# EAGLE design capsense-board (EAGLE 7.4.0)
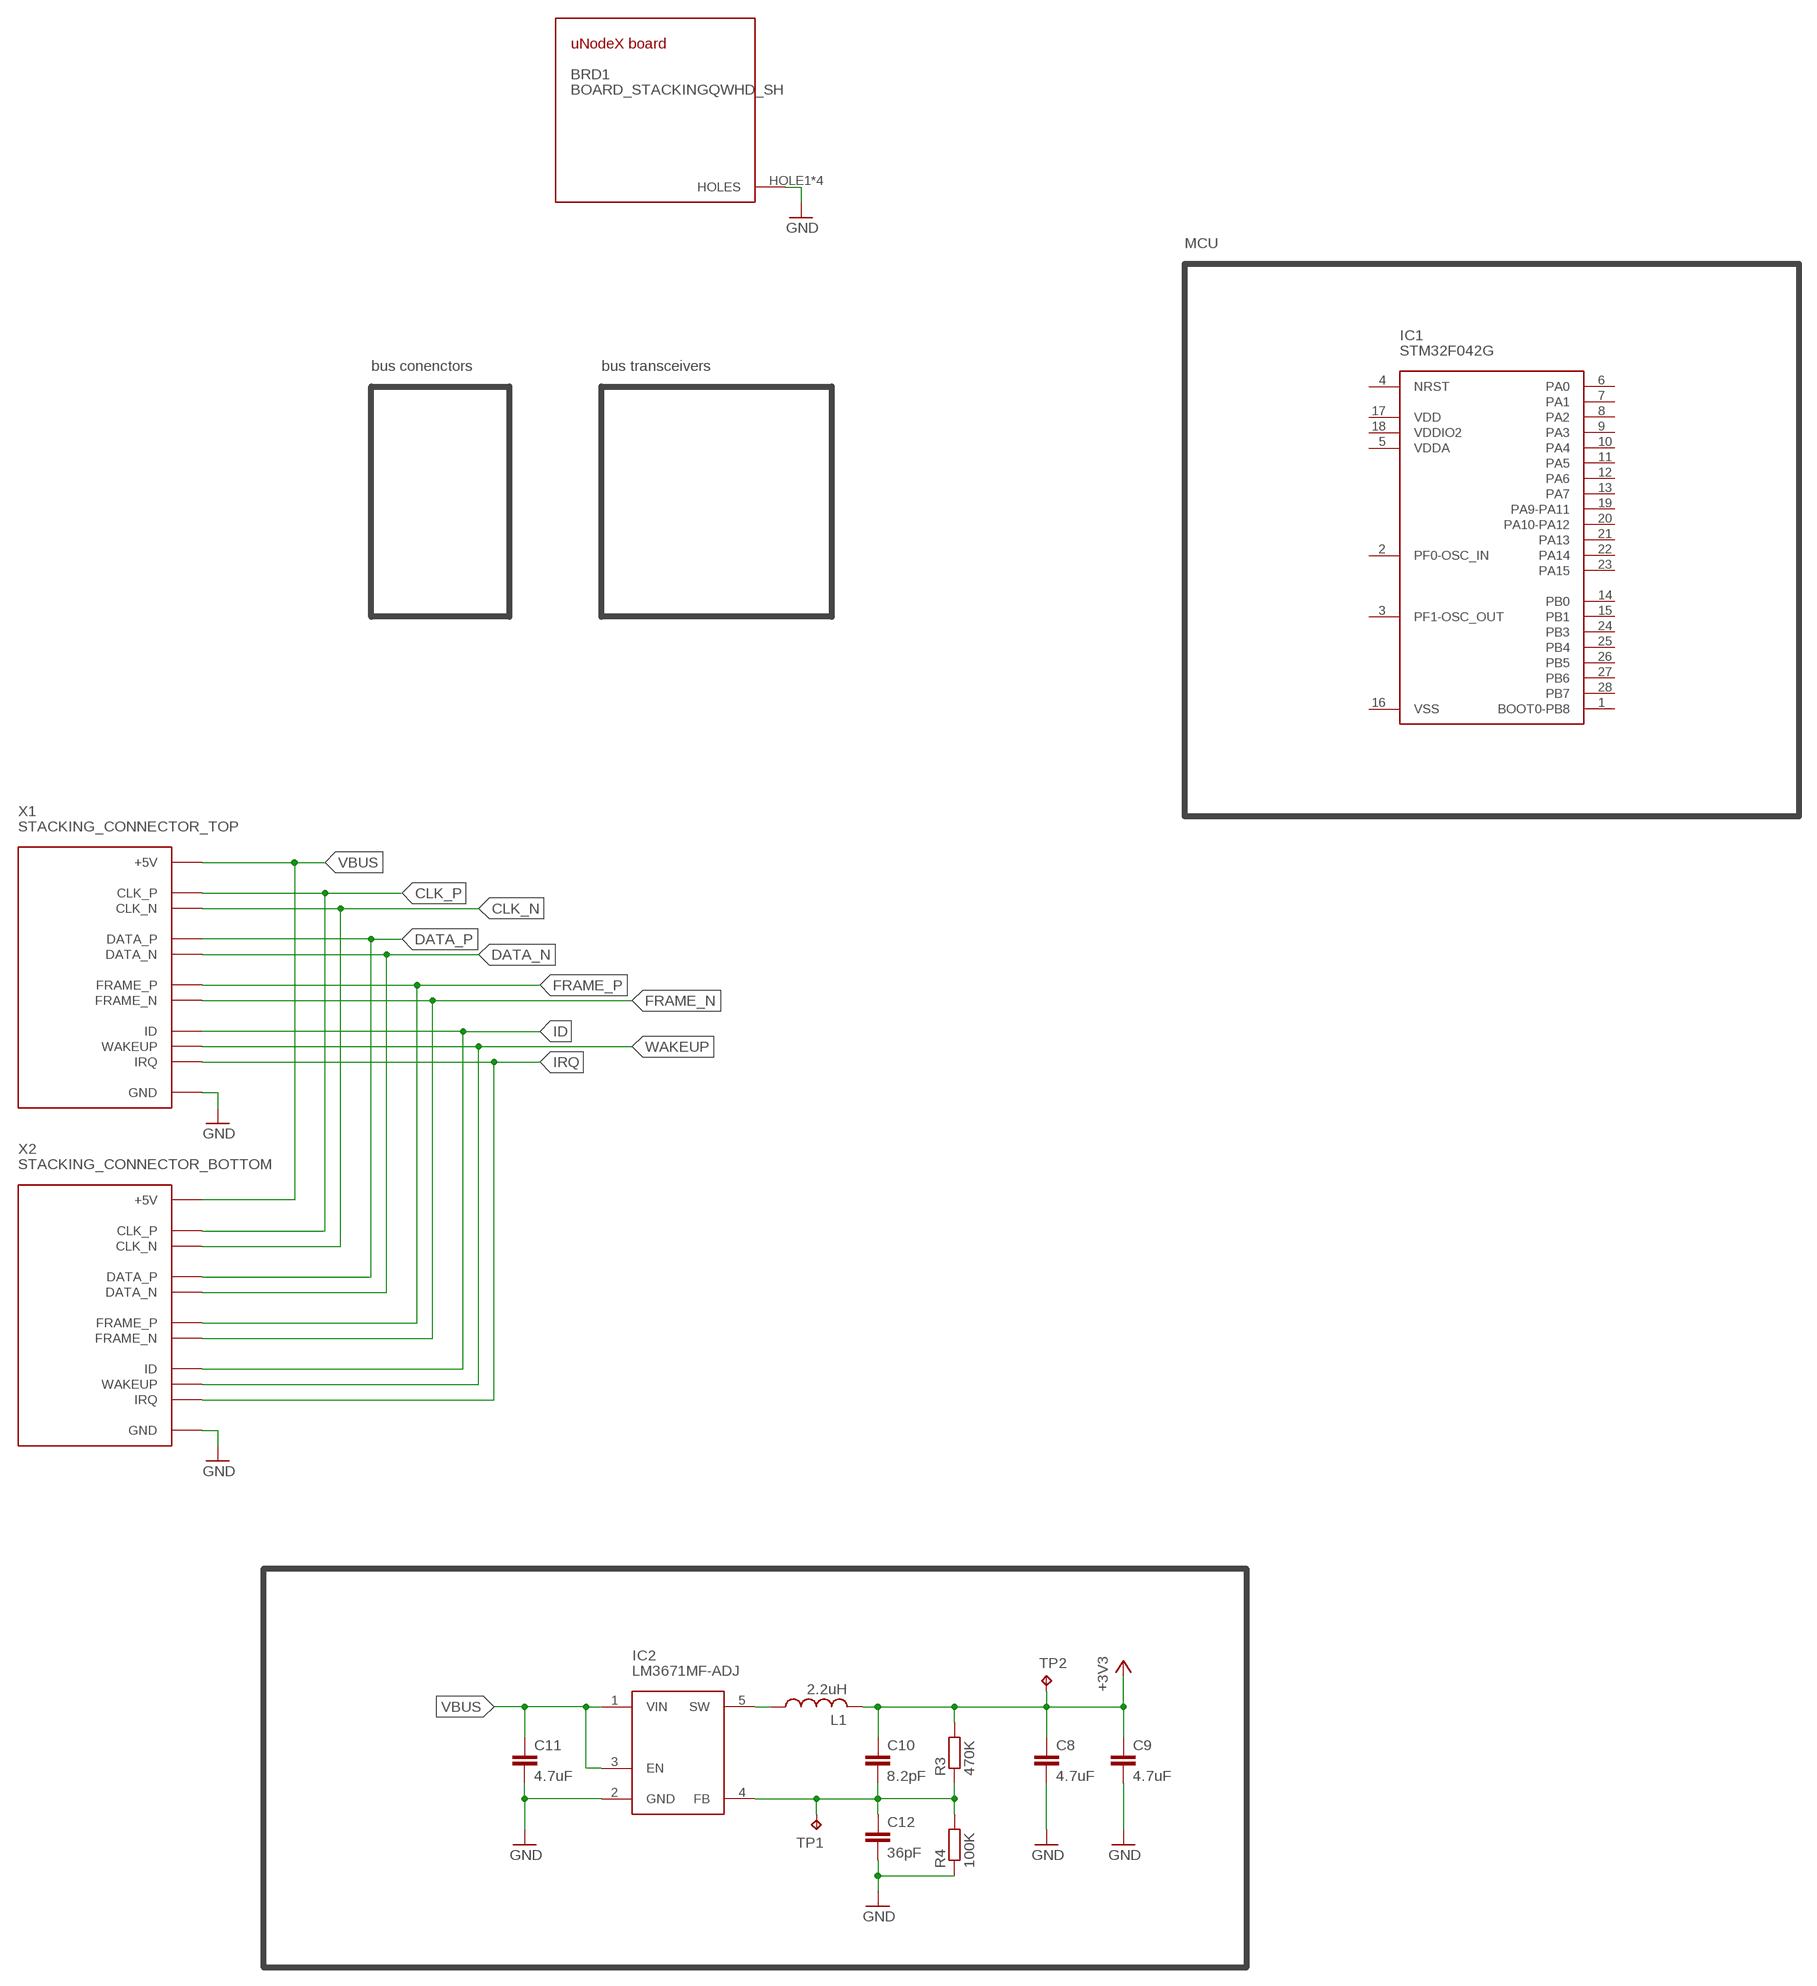
[diagram p0: schematic, sheet 1]

## Parts
BRD1  BOARD_STACKINGQWHD_SH  [QWHD_SHARP_CORNERS]
C8  4.7uF  C-EUC0805  [C0805]
C9  4.7uF  C-EUC0805  [C0805]
C10  8.2pF  C-EUC0603  [C0603]
C11  4.7uF  C-EUC0805  [C0805]
C12  36pF  C-EUC0603  [C0603]
IC1  STM32F042G  [UFQFPN28]
IC2  LM3671MF-ADJ  LM3671MF  [SOT23-5]
L1  2.2uH  L-USL2012C  [L2012C]
R3  470K  R-EU_R0603  [R0603]
R4  100K  R-EU_R0603  [R0603]
TP1  TPB1,27  [B1,27]
TP2  TPB1,27  [B1,27]
X1  STACKING_CONNECTOR_TOP  [HAR-FLEX-TOP-12P]
X2  STACKING_CONNECTOR_BOTTOM  [HAR-FLEX-BOTTOM-12P]

## Nets
+3V3: C8.1 C9.1 C10.1 L1.2 R3.2 TP2.TP
CLK_N: X1.CLK_N X2.CLK_N
CLK_P: X1.CLK_P X2.CLK_P
DATA_N: X1.DATA_N X2.DATA_N
DATA_P: X1.DATA_P X2.DATA_P
FRAME_N: X1.FRAME_N X2.FRAME_N
FRAME_P: X1.FRAME_P X2.FRAME_P
GND: BRD1.HOLE1(HOLES) BRD1.HOLE2(HOLES) BRD1.HOLE3(HOLES) BRD1.HOLE4(HOLES) C8.2 C9.2 C11.2 C12.2 IC2.2(GND) R4.1 X1.GND1(GND) X1.GND2(GND) X1.H1(GND) X1.H2(GND) X1.H3(GND) X1.H4(GND) X2.GND1(GND) X2.GND2(GND) X2.H1(GND) X2.H2(GND) X2.H3(GND) X2.H4(GND)
ID: X1.ID X2.ID
IRQ: X1.IRQ X2.IRQ
N$3: IC2.5(SW) L1.1
N$7: C10.2 C12.1 IC2.4(FB) R3.1 R4.2 TP1.TP
VBUS: C11.1 IC2.1(VIN) IC2.3(EN) X1.+5V X2.+5V
WAKEUP: X1.WAKEUP X2.WAKEUP
Unconnected: IC1.1(BOOT0-PB8) IC1.2(PF0-OSC_IN) IC1.3(PF1-OSC_OUT) IC1.4(NRST) IC1.5(VDDA) IC1.6(PA0) IC1.7(PA1) IC1.8(PA2) IC1.9(PA3) IC1.10(PA4) IC1.11(PA5) IC1.12(PA6) IC1.13(PA7) IC1.14(PB0) IC1.15(PB1) IC1.16(VSS) IC1.17(VDD) IC1.18(VDDIO2) IC1.19(PA9-PA11) IC1.20(PA10-PA12) IC1.21(PA13) IC1.22(PA14) IC1.23(PA15) IC1.24(PB3) IC1.25(PB4) IC1.26(PB5) IC1.27(PB6) IC1.28(PB7)

## Notes on the sheet
- MCU
- bus conenctors | bus transceivers

## Library data of the parts
BRD1 = unodex-boards:BOARD_STACKING
C8-C12 = rcl:C-EU: CAPACITOR, European symbol
IC1 = stm32f042xx:STM32F042G
IC2 = qyx-misc:LM3671
L1 = rcl:L-US: INDUCTOR, American symbol
R3 R4 = rcl:R-EU_: RESISTOR, European symbol
TP1 TP2 = testpad:TP: Test pad
X1 = unodex-boards:STACKING_CONNECTOR_TOP
X2 = unodex-boards:STACKING_CONNECTOR_BOTTOM

## Board
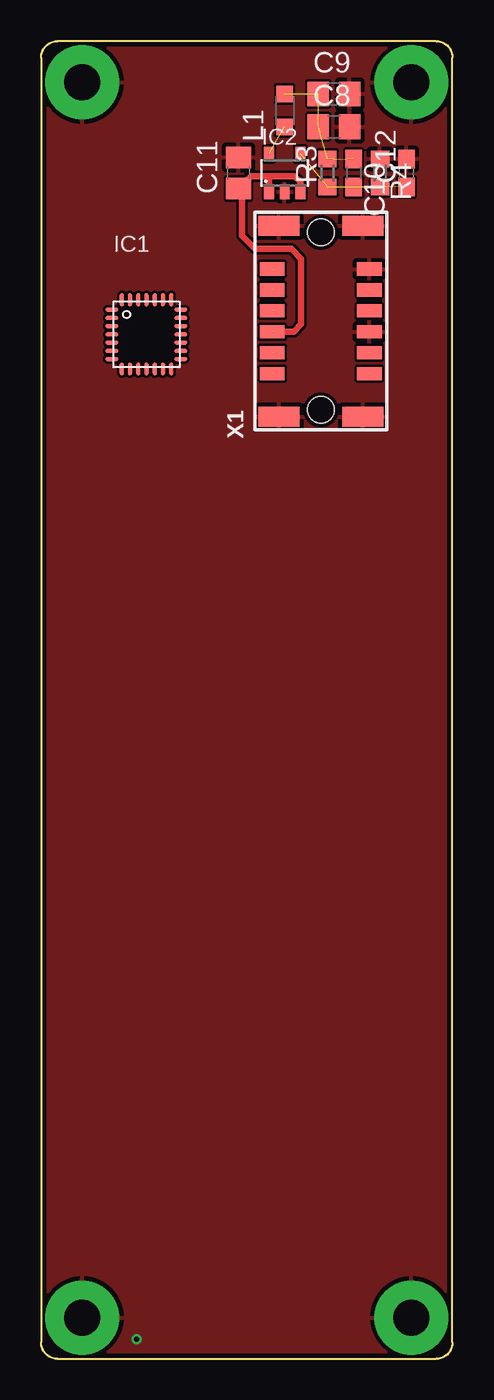
[diagram p1: board, top side]
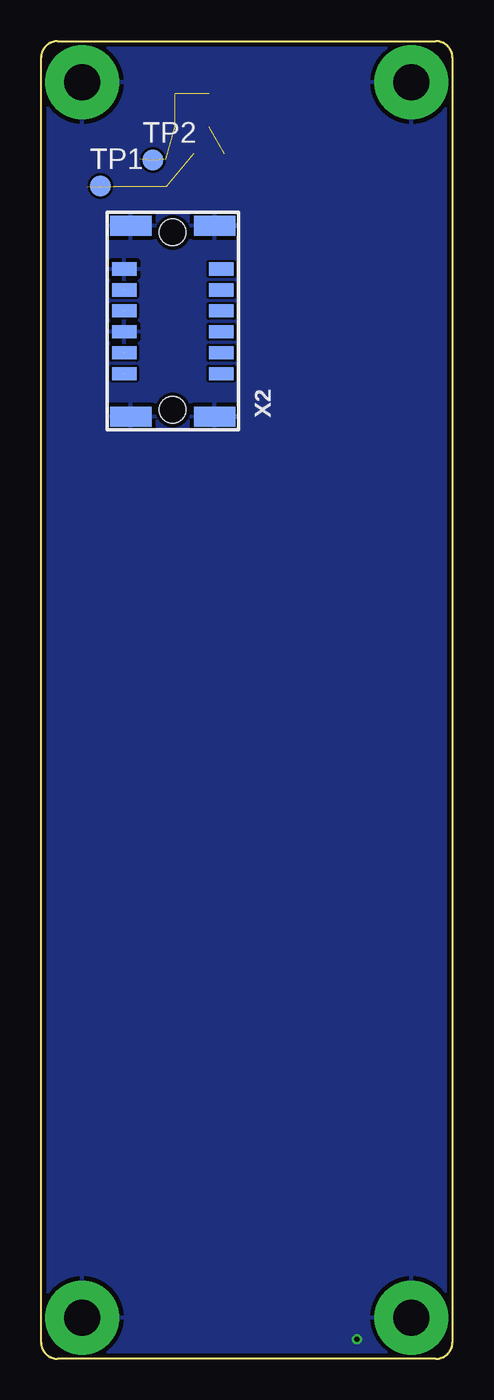
[diagram p2: board, bottom side, seen from below]

Size 25 x 80 mm. Coordinates in mm from the lower left corner, seen from the top.
Copper layers (1*16): Top 0.035mm / dielectric 1.5mm / Bottom 0.035mm
Design rules "seeed": minimum track width 6mil, minimum drill 0.3mm, track to track 6mil, track to pad 6mil, pad to pad 6mil, via to via 6mil, smd to smd 0mil, copper to edge 10mil, drill to drill 10mil, minimum pad ring 6mil, minimum via ring 6mil, stop-mask expansion 2mil, vias tented up to drill 0.5mm, thermal gap 10mil

### Footprints (pad centres in the part's own frame; a part is rotated, then mirrored left to right if it is on the bottom)
QWHD_SHARP_CORNERS = drill 2.2 pad 4.5: HOLE1 2.5,2.5; HOLE2 22.5,2.5; HOLE3 22.5,77.5; HOLE4 2.5,77.5
C0805 = smd 1.3 x 1.5: 1 -0.95,0; 2 0.95,0
C0603 = smd 1.1 x 1: 1 -0.85,0; 2 0.85,0
UFQFPN28 = smd 0.8 x 0.25: 1 -2.1,1.5; 2 -2.1,1; 3 -2.1,0.5; 4 -2.1,0; 5 -2.1,-0.5; 6 -2.1,-1; 7 -2.1,-1.5; 15 2.1,-1.5; 16 2.1,-1; 17 2.1,-0.5; 18 2.1,0; 19 2.1,0.5; 20 2.1,1; 21 2.1,1.5 | smd 0.25 x 0.8: 8 -1.5,-2.1; 9 -1,-2.1; 10 -0.5,-2.1; 11 0,-2.1; 12 0.5,-2.1; 13 1,-2.1; 14 1.5,-2.1; 22 1.5,2.1; 23 1,2.1; 24 0.5,2.1; 25 0,2.1; 26 -0.5,2.1; 27 -1,2.1; 28 -1.5,2.1
SOT23-5 = smd 0.6 x 0.9: 1 -0.95,-1.15; 2 0,-1.15; 3 0.95,-1.15; 4 0.95,1.15; 5 -0.95,1.15
L2012C = smd 1 x 1: 1 -1,0; 2 1,0
R0603 = smd 1 x 1.1: 1 -0.85,0; 2 0.85,0
B1,27 = smd 1.27 x 1.27: TP 0,0
HAR-FLEX-TOP-12P = smd 1.5 x 0.8: +5V -10.95,-17.645; CLK_N -5.05,-16.375; CLK_P -5.05,-15.105; DATA_N -5.05,-20.185; DATA_P -5.05,-18.915; FRAME_N -10.95,-20.185; FRAME_P -10.95,-18.915; GND1 -5.05,-13.835; GND2 -5.05,-17.645; ID -10.95,-16.375; IRQ -10.95,-13.835; WAKEUP -10.95,-15.105 | smd 2.5 x 1.2: H1 -10.55,-22.8; H2 -5.45,-22.8; H3 -5.45,-11.2; H4 -10.55,-11.2 | hole 1.6: -8,-11.615; -8,-22.385
HAR-FLEX-BOTTOM-12P = smd 1.5 x 0.8 bottom: +5V -10.95,-17.645; CLK_N -5.05,-16.375; CLK_P -5.05,-15.105; DATA_N -5.05,-20.185; DATA_P -5.05,-18.915; FRAME_N -10.95,-20.185; FRAME_P -10.95,-18.915; GND1 -5.05,-13.835; GND2 -5.05,-17.645; ID -10.95,-16.375; IRQ -10.95,-13.835; WAKEUP -10.95,-15.105 | smd 2.5 x 1.2 bottom: H1 -10.55,-22.8; H2 -5.45,-22.8; H3 -5.45,-11.2; H4 -10.55,-11.2 | hole 1.6: -8,-11.615; -8,-22.385

### Placement (x,y rotation side)
BRD1  0,0 0 top
C8  17.8,74.8 0 top
C9  17.8,76.8 0 top
C10  19,72 270 top
C11  12,72 90 top
C12  22.2,72 90 top
IC1  6.4,62.2 0 top
IC2  14.8,72 0 top
L1  14.8,75.8 90 top
R3  17.4,72 90 top
R4  20.6,72 270 top
TP1  21.4,71.2 0 bottom
TP2  18.2,72.8 0 bottom
X1  25,80 0 top
X2  25,80 0 top

### Tracks (layer width: path | path; a pad name or v marks a point on that pad's centre or on a via)
+3V3  (5 unrouted)
CLK_N  (1 unrouted)
CLK_P  (1 unrouted)
DATA_N  (1 unrouted)
DATA_P  (1 unrouted)
FRAME_N  (1 unrouted)
FRAME_P  (1 unrouted)
GND  (via drill 0.3)
  other vias: 5.8,1.2
  pour Bottom (rank 2): 10.4,0 24,0 arc90 25,1 25,79 arc90 24,80 1,80 arc90 0,79 0,1 arc90 1,0
  pour Top (rank 2): 10.4,0 24,0 arc90 25,1 25,79 arc90 24,80 1,80 arc90 0,79 0,1 arc90 1,0
ID  (1 unrouted)
IRQ  (1 unrouted)
N$3  (1 unrouted)
N$7  (5 unrouted)
VBUS  (1 unrouted)
  Top 0.406: X2.+5V 15.36,62.35 15.8,62.8 15.8,66.8 15.2,67.4 13,67.4 12.2,68.2 12.2,70.85 C11.1 12.75,71.8 13.8,71.8 | IC2.3 15.75,71.45 15.4,71.8 13.8,71.8 | IC2.1 13.85,71.75 13.8,71.8
WAKEUP  (1 unrouted)